# EAGLE design aasaver_v11 (EAGLE 6.1)
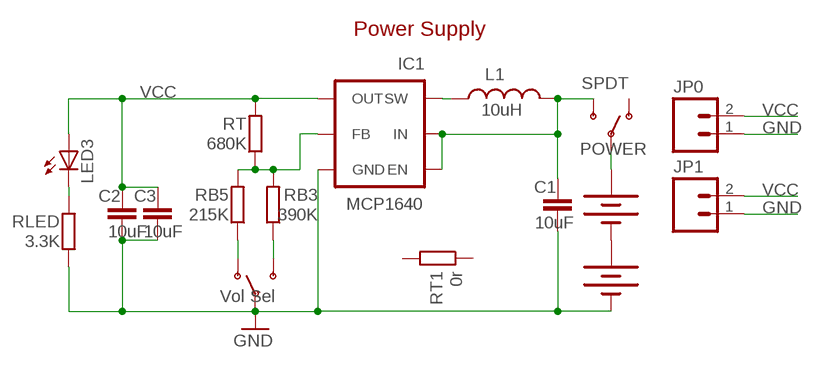
[diagram p0: schematic, sheet 1]

## Parts
AA1  BATTERYAA  [BATTERY-AA]
AA2  BATTERYAA  [BATTERY-AA]
C1  10uF  C-EUC0805  [C0805]
C2  10uF  C-EUC0805  [C0805]
C3  10uF  C-EUC0805  [C0805]
IC1  MCP1640  [TSOT23-6]
JP0  M021X02_NO_SILK  [1X02_NO_SILK]
JP1  M021X02_NO_SILK  [1X02_NO_SILK]
L1  10uH  INDUCTOR_SMDD45  [INDUCTOR_D45]
LED3  0805  LEDCHIPLED_1206  [CHIPLED_1206]
POWER  SPDT  SWITCH-SPSTSMD2  [SWITCH-SPDT-SMD]
RB3  390K  R-EU_R0805  [R0805]
RB5  215K  R-EU_R0805  [R0805]
RLED  3.3K  R-EU_R0805  [R0805]
RT  680K  R-EU_R0805  [R0805]
RT1  0r  R-EU_R1206  [R1206]
VOL1  Vol Sel  SWITCH-SPSTSMD2  [SWITCH-SPDT-SMD]

## Nets
GND: AA2.GND@1(-) C1.2 C2.2 C3.2 IC1.2(GND) JP0.1 JP1.1 RLED.1 VOL1.2(P)
N$1: IC1.4(FB) RB3.2 RB5.2 RT.1
N$2: RB5.1 VOL1.1(O)
N$3: RB3.1 VOL1.3(S)
N$6: AA1.PWR@1(+) POWER.2(P)
N$8: LED3.C RLED.2
N$16: AA1.GND@1(-) AA2.PWR@1(+)
N$26 [power]: IC1.1(SW) L1.P$2
PWR [power]: C1.1 IC1.3(EN) IC1.6(IN) L1.P$1 POWER.3(S)
VCC: C2.1 C3.1 IC1.5(OUT) JP0.2 JP1.2 LED3.A RT.2
Unconnected: POWER.1(O) RT1.1 RT1.2

## Notes on the sheet
- Power Supply

## Library data of the parts
AA1 AA2 = SparkFun:BATTERY: Battery Holders Various common sizes : AA, AAA, 20mm coin cell and 12mm coin cell.
C1-C3 = resistor:C-EU: CAPACITOR, European symbol
IC1 = linear-technology:MCP1640
JP0 JP1 = SparkFun:M02: Header 2 Standard 2-pin 0.1" header. Use with straight break away headers (SKU : PRT-00116), right angle break away headers (PRT-00553), swiss pins (PRT-00743), machine pins (PRT-00117), and female headers (PRT-00115). Molex polarized connector foot print use with SKU : PRT-08233 with associated crimp pins and housings.
L1 = linear-technology:INDUCTOR_SMD
LED3 = led:LED: LED OSRAM: - CHIPLED LG R971, LG N971, LY N971, LG Q971, LY Q971, LO R971, LY R971 LH N974, LH R974 LS Q976, LO Q976, LY Q976 LO Q996 - Hyper CHIPLED LW Q18S LB Q993, LB Q99A, LB R99A - SideLED LS A670, LO A670, LY A670, LG A670, LP A670 LB A673, LV A673, LT A673, LW A673 LH A674 LY A675 LS A676, LA A676, LO A676, LY A676, LW A676 LS A679, LY A679, LG A679 - Hyper Micro SIDELED® LS Y876, LA Y876, LO Y876, LY Y876 LT Y87S - SmartLED LW L88C, LW L88S LB L89C, LB L89S, LG L890 LS L89K, LO L89K, LY L89K LS L896, LA L896, LO L896, LY L896 - TOPLED LS T670, LO T670, LY T670, LG T670, LP T670 LSG T670, LSP T670, LSY T670, LOP T670, LYG T670 LG T671, LOG T671, LSG T671 LB T673, LV T673, LT T673, LW T673 LH T674 LS T676, LA T676, LO T676, LY T676, LB T676, LH T676, LSB T676, LW T676 LB T67C, LV T67C, LT T67C, LS T67K, LO T67K, LY T67K, LW E67C LS E67B, LA E67B, LO E67B, LY E67B, LB E67C, LV E67C, LT E67C LW T67C LS T679, LY T679, LG T679 LS T770, LO T770, LY T770, LG T770, LP T770 LB T773, LV T773, LT T773, LW T773 LH T774 LS E675, LA E675, LY E675, LS T675 LS T776, LA T776, LO T776, LY T776, LB T776 LHGB T686 LT T68C, LB T68C - Hyper Mini TOPLED® LB M676 - Mini TOPLED Santana® LG M470 LS M47K, LO M47K, LY M47K Source: http://www.osram.convergy.de LUXEON: - LUMILED® LXK2-PW12-R00, LXK2-PW12-S00, LXK2-PW14-U00, LXK2-PW14-V00 LXK2-PM12-R00, LXK2-PM12-S00, LXK2-PM14-U00 LXK2-PE12-Q00, LXK2-PE12-R00, LXK2-PE12-S00, LXK2-PE14-T00, LXK2-PE14-U00 LXK2-PB12-K00, LXK2-PB12-L00, LXK2-PB12-M00, LXK2-PB14-N00, LXK2-PB14-P00, LXK2-PB14-Q00 LXK2-PR12-L00, LXK2-PR12-M00, LXK2-PR14-Q00, LXK2-PR14-R00 LXK2-PD12-Q00, LXK2-PD12-R00, LXK2-PD12-S00 LXK2-PH12-R00, LXK2-PH12-S00 LXK2-PL12-P00, LXK2-PL12-Q00, LXK2-PL12-R00 Source: www.luxeon.com KINGBRIGHT: KA-3528ASYC Source: www.kingbright.com
POWER VOL1 = SparkFun:SWITCH-SPST: SPST Switch Simple slide switch. Spark Fun Electronics SKU : COM-00102
RB3 RB5 RLED RT RT1 = rcl:R-EU_: RESISTOR, European symbol

## Net classes
0 default: width 0.406 mm, clearance 0.203 mm
1 power: width 0.406 mm, clearance 0.203 mm

## Board
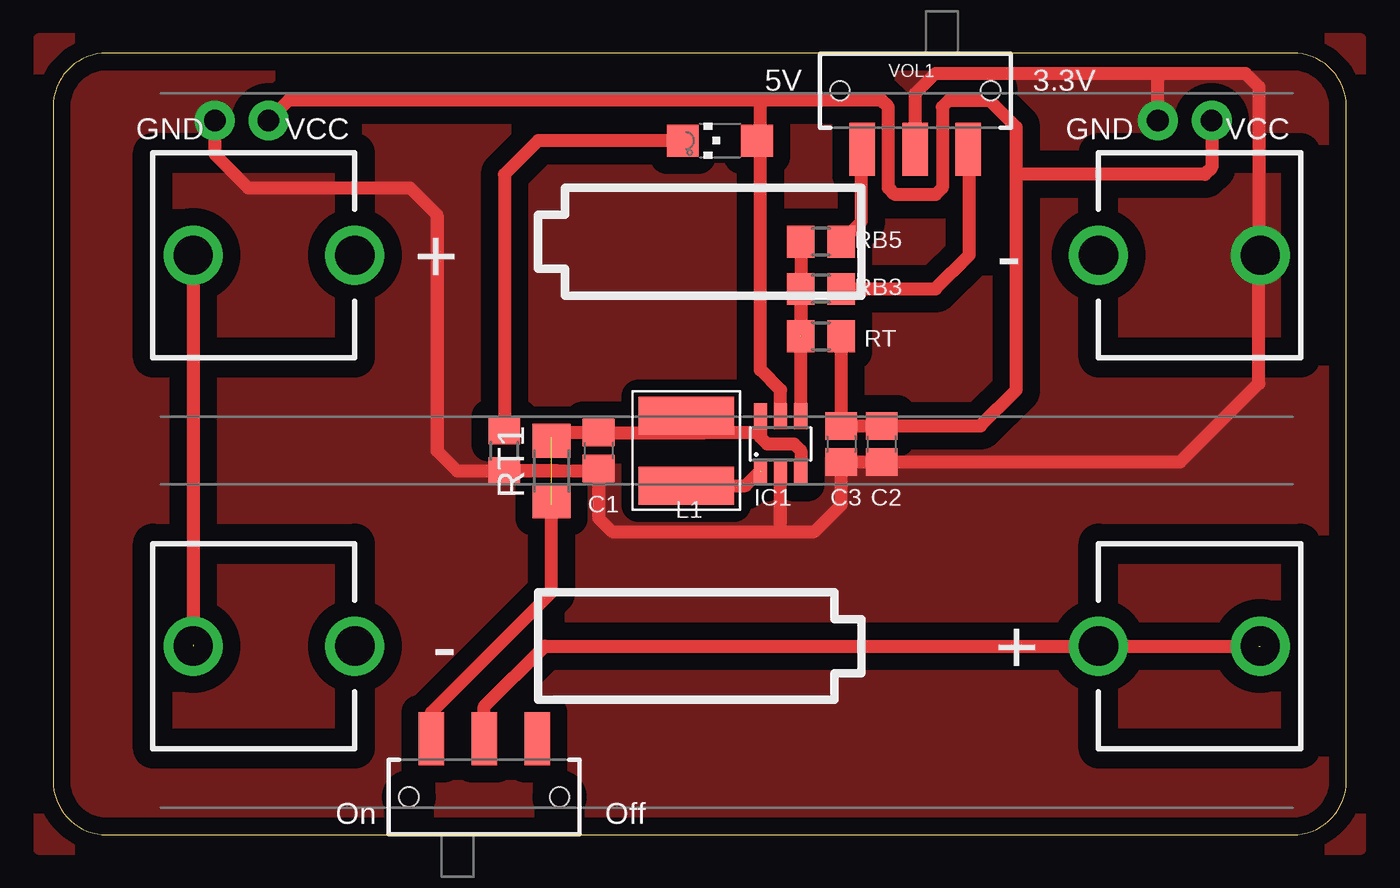
[diagram p1: board, top side]

Size 60.96 x 36.83 mm. Coordinates in mm from the lower left corner, seen from the top.
Outline: 2.54,0 58.42,0 arc90 60.96,2.54 60.96,34.29 arc90 58.42,36.83 2.54,36.83 arc90 0,34.29 0,2.54 arc90 2.54,0
Copper layers (1*16): Top 0.035mm / dielectric 1.5mm / Bottom 0.035mm
Design rules: minimum track width 6mil, minimum drill 12mil, track to track 6mil, track to pad 6mil, pad to pad 6mil, via to via 6mil, smd to smd 0mil, copper to edge 10mil, drill to drill 10mil, minimum pad ring 10mil, minimum via ring 6mil, stop-mask expansion 2mil, vias tented up to drill 100mil, thermal gap 20mil

### Footprints (pad centres in the part's own frame; a part is rotated, then mirrored left to right if it is on the bottom)
BATTERY-AA = drill 1.854: GND@1 25.146,0; GND@2 17.526,0; PWR@1 -25.146,0; PWR@2 -17.526,0
C0805 = smd 1.3 x 1.5: 1 -0.85,0; 2 0.85,0
TSOT23-6 = smd 0.62 x 1.22: 1 -0.95,-1.3; 2 0,-1.3; 3 0.95,-1.3; 4 0.95,1.3; 5 0,1.3; 6 -0.95,1.3
1X02_NO_SILK = drill 1.016 pad 1.88: 1 0,0; 2 2.54,0
INDUCTOR_D45 = smd 1.8 x 4.5: P$1 -1.65,0; P$2 1.65,0
CHIPLED_1206 = smd 1.5 x 1.5: A 0,-1.75; C 0,1.75
SWITCH-SPDT-SMD = smd 1.2 x 2.5: 1 -2.5,-2.75; 2 0,-2.75; 3 2.5,-2.75 | hole 0.9: -3.55,0; 3.55,0
R0805 = smd 1.3 x 1.5: 1 -0.95,0; 2 0.95,0
R1206 = smd 1.6 x 1.803: 1 -1.422,0; 2 1.422,0

### Placement (x,y rotation side)
AA1  31.75,8.89 180 top
AA2  31.75,27.3 0 top
C1  25.72,18.1 270 top
C2  39.05,18.41 270 top
C3  37.15,18.41 270 top
IC1  34.29,18.41 0 top
JP0  52.07,33.66 0 top
JP1  7.62,33.66 0 top
L1  29.84,18.1 270 top
LED3  31.43,32.7 90 top
POWER  20.32,1.78 180 top
RB3  36.2,25.72 180 top
RB5  36.2,27.94 180 top
RLED  21.27,18.1 90 top
RT  36.2,23.5 0 top
RT1  23.5,17.14 90 top
VOL1  40.64,35.05 0 top

### Tracks (layer width: path | path; a pad name or v marks a point on that pad's centre or on a via)
GND
  Top 0.61: 34.29,14.29 26.35,14.29 25.72,14.92 C1.2 25.62,17.15 RLED.1 23.81,17.14 | 34.29,14.29 35.88,14.29 37.15,15.56 C3.2 C2.2 53.12,17.57 56.83,21.27 56.83,27.24 AA2.GND@1 56.83,27.37 56.83,35.24 56.2,35.88 52.07,35.88 | 34.29,14.29 IC1.2 | VOL1.2 40.64,34.92 41.59,35.88 52.07,35.88 | JP0.1 52.07,35.88 | JP1.1 7.62,32.07 9.21,30.48 16.83,30.48 18.1,29.21 18.1,18.1 19.05,17.14 RLED.1
  pour Top (isolate 0.813, no thermals): -0.64,-0.64 61.59,-0.64 61.59,37.47 -0.64,37.47
N$1  (1 unrouted)
  Top 0.61: IC1.4 35.24,21.59 RB3.2 RT.1 | RB5.2 RT.1
N$2
  Top 0.61: RB5.1 38.1,28.89 38.1,32.26 VOL1.1
N$3
  Top 0.61: RB3.1 41.59,25.72 43.18,27.3 43.18,32.26 VOL1.3
N$6  (1 unrouted)
  Top 0.61: POWER.2 20.32,6.03 23.18,8.89 56.83,8.89
N$8
  Top 0.61: LED3.C 22.86,32.7 21.27,31.11 RLED.2
N$16  (1 unrouted)
  Top 0.61: AA2.PWR@1 6.6,8.95 6.67,8.89
N$26  (1 unrouted)
  Top 0.61: L1.P$2 32.64,16.45 33.34,17.14
PWR  (1 unrouted)
  Top 0.61: IC1.6 33.34,18.84 | IC1.3 35.24,18.1 34.92,18.41 33.66,18.41 33.34,18.73 33.34,18.84 | 30.73,18.95 C1.1 23.71,18.95 23.5,18.73 | 33.23,18.95 33.34,19.05 | 33.23,18.95 30.73,18.95 | 30.73,18.95 L1.P$1 | 33.34,18.84 33.23,18.95 | POWER.3 17.82,5.75 23.5,11.43 23.5,15.56
VCC
  Top 0.61: C3.1 C2.1 39.16,19.37 | C3.1 RT.2 | 33.34,34.61 39.05,34.61 39.37,34.29 39.37,30.48 39.69,30.16 41.59,30.16 41.91,30.48 41.91,34.29 42.23,34.61 44.13,34.61 45.4,33.34 45.4,31.11 | 33.34,34.61 11.11,34.61 JP1.2 | IC1.5 34.29,20.95 33.34,21.91 33.34,32.7 | 33.34,32.7 33.34,34.61 | LED3.A 33.34,32.7 | C3.1 43.71,19.27 45.4,20.95 45.4,31.11 | JP0.2 54.61,31.43 54.29,31.11 45.4,31.11

### Text on the board
tNames: 5V | 3.3V | GND | VCC | GND | VCC | On | Off